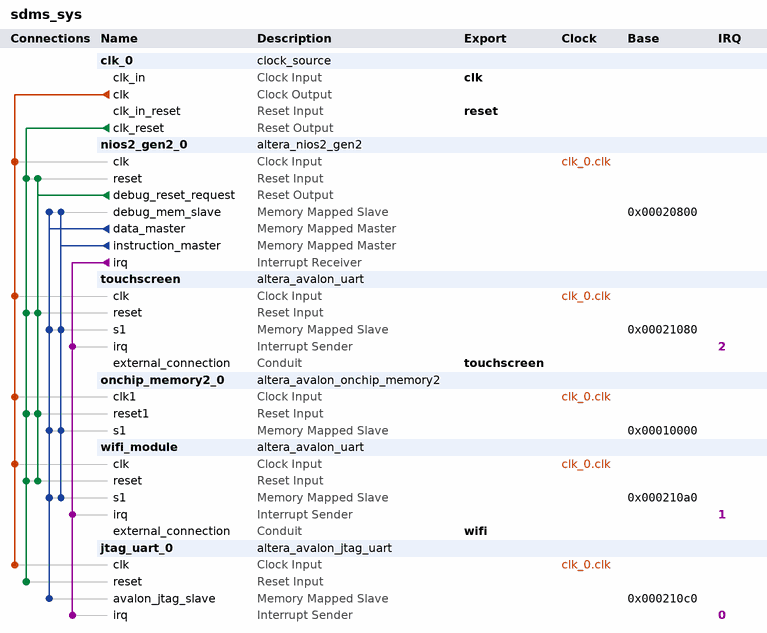
[diagram p0: system contents]
# Platform Designer (Qsys) system sdms_sys, Cyclone V 5CSEMA5F31C6
# Parameters at their usual value, and those the tool derives, are not listed.
package require -exact qsys 18.1
create_system sdms_sys
set_project_property DEVICE_FAMILY {Cyclone V}
set_project_property DEVICE 5CSEMA5F31C6

add_instance clk_0 clock_source 18.1
set_instance_parameter_value clk_0 clockFrequency 50000000

add_instance nios2_gen2_0 altera_nios2_gen2 18.1
set_instance_parameter_value nios2_gen2_0 dcache_size 2048
set_instance_parameter_value nios2_gen2_0 exceptionSlave onchip_memory2_0.s1
set_instance_parameter_value nios2_gen2_0 icache_size 4096
set_instance_parameter_value nios2_gen2_0 impl Tiny
set_instance_parameter_value nios2_gen2_0 resetSlave onchip_memory2_0.s1

add_instance touchscreen altera_avalon_uart 18.1
set_instance_parameter_value touchscreen baud 9600
set_instance_parameter_value touchscreen dataBits 8
set_instance_parameter_value touchscreen fixedBaud true
set_instance_parameter_value touchscreen parity NONE
set_instance_parameter_value touchscreen stopBits 1

add_instance onchip_memory2_0 altera_avalon_onchip_memory2 18.1
set_instance_parameter_value onchip_memory2_0 dataWidth 32
set_instance_parameter_value onchip_memory2_0 dualPort false
set_instance_parameter_value onchip_memory2_0 initMemContent true
set_instance_parameter_value onchip_memory2_0 initializationFileName onchip_mem.hex
set_instance_parameter_value onchip_memory2_0 memorySize 40960

add_instance wifi_module altera_avalon_uart 18.1
set_instance_parameter_value wifi_module baud 115200
set_instance_parameter_value wifi_module dataBits 8
set_instance_parameter_value wifi_module fixedBaud true
set_instance_parameter_value wifi_module parity NONE
set_instance_parameter_value wifi_module stopBits 1

add_instance jtag_uart_0 altera_avalon_jtag_uart 18.1
set_instance_parameter_value jtag_uart_0 simInteractiveOptions NO_INTERACTIVE_WINDOWS

# connections
add_connection clk_0.clk jtag_uart_0.clk clock
add_connection clk_0.clk nios2_gen2_0.clk clock
add_connection clk_0.clk onchip_memory2_0.clk1 clock
add_connection clk_0.clk touchscreen.clk clock
add_connection clk_0.clk wifi_module.clk clock
add_connection clk_0.clk_reset jtag_uart_0.reset reset
add_connection clk_0.clk_reset nios2_gen2_0.reset reset
add_connection clk_0.clk_reset onchip_memory2_0.reset1 reset
add_connection clk_0.clk_reset touchscreen.reset reset
add_connection clk_0.clk_reset wifi_module.reset reset
add_connection nios2_gen2_0.debug_reset_request nios2_gen2_0.reset reset
add_connection nios2_gen2_0.debug_reset_request onchip_memory2_0.reset1 reset
add_connection nios2_gen2_0.debug_reset_request touchscreen.reset reset
add_connection nios2_gen2_0.debug_reset_request wifi_module.reset reset
add_connection nios2_gen2_0.data_master jtag_uart_0.avalon_jtag_slave avalon
set_connection_parameter_value nios2_gen2_0.data_master/jtag_uart_0.avalon_jtag_slave baseAddress 0x000210c0
add_connection nios2_gen2_0.data_master nios2_gen2_0.debug_mem_slave avalon
set_connection_parameter_value nios2_gen2_0.data_master/nios2_gen2_0.debug_mem_slave baseAddress 0x00020800
add_connection nios2_gen2_0.data_master onchip_memory2_0.s1 avalon
set_connection_parameter_value nios2_gen2_0.data_master/onchip_memory2_0.s1 baseAddress 0x00010000
add_connection nios2_gen2_0.data_master touchscreen.s1 avalon
set_connection_parameter_value nios2_gen2_0.data_master/touchscreen.s1 baseAddress 0x00021080
add_connection nios2_gen2_0.data_master wifi_module.s1 avalon
set_connection_parameter_value nios2_gen2_0.data_master/wifi_module.s1 baseAddress 0x000210a0
add_connection nios2_gen2_0.instruction_master nios2_gen2_0.debug_mem_slave avalon
set_connection_parameter_value nios2_gen2_0.instruction_master/nios2_gen2_0.debug_mem_slave baseAddress 0x00020800
add_connection nios2_gen2_0.instruction_master onchip_memory2_0.s1 avalon
set_connection_parameter_value nios2_gen2_0.instruction_master/onchip_memory2_0.s1 baseAddress 0x00010000
add_connection nios2_gen2_0.instruction_master touchscreen.s1 avalon
set_connection_parameter_value nios2_gen2_0.instruction_master/touchscreen.s1 baseAddress 0x00021080
add_connection nios2_gen2_0.instruction_master wifi_module.s1 avalon
set_connection_parameter_value nios2_gen2_0.instruction_master/wifi_module.s1 baseAddress 0x000210a0
add_connection nios2_gen2_0.irq jtag_uart_0.irq interrupt
set_connection_parameter_value nios2_gen2_0.irq/jtag_uart_0.irq irqNumber 0
add_connection nios2_gen2_0.irq touchscreen.irq interrupt
set_connection_parameter_value nios2_gen2_0.irq/touchscreen.irq irqNumber 2
add_connection nios2_gen2_0.irq wifi_module.irq interrupt
set_connection_parameter_value nios2_gen2_0.irq/wifi_module.irq irqNumber 1

# exported interfaces
add_interface clk clock sink
set_interface_property clk EXPORT_OF clk_0.clk_in
add_interface reset reset sink
set_interface_property reset EXPORT_OF clk_0.clk_in_reset
add_interface touchscreen conduit end
set_interface_property touchscreen EXPORT_OF touchscreen.external_connection
add_interface wifi conduit end
set_interface_property wifi EXPORT_OF wifi_module.external_connection

set_interconnect_requirement {$system} qsys_mm.clockCrossingAdapter HANDSHAKE
set_interconnect_requirement {$system} qsys_mm.enableEccProtection FALSE
set_interconnect_requirement {$system} qsys_mm.insertDefaultSlave FALSE
set_interconnect_requirement {$system} qsys_mm.maxAdditionalLatency 1

save_system sdms_sys.qsys
